# EAGLE design main (EAGLE 6.1)
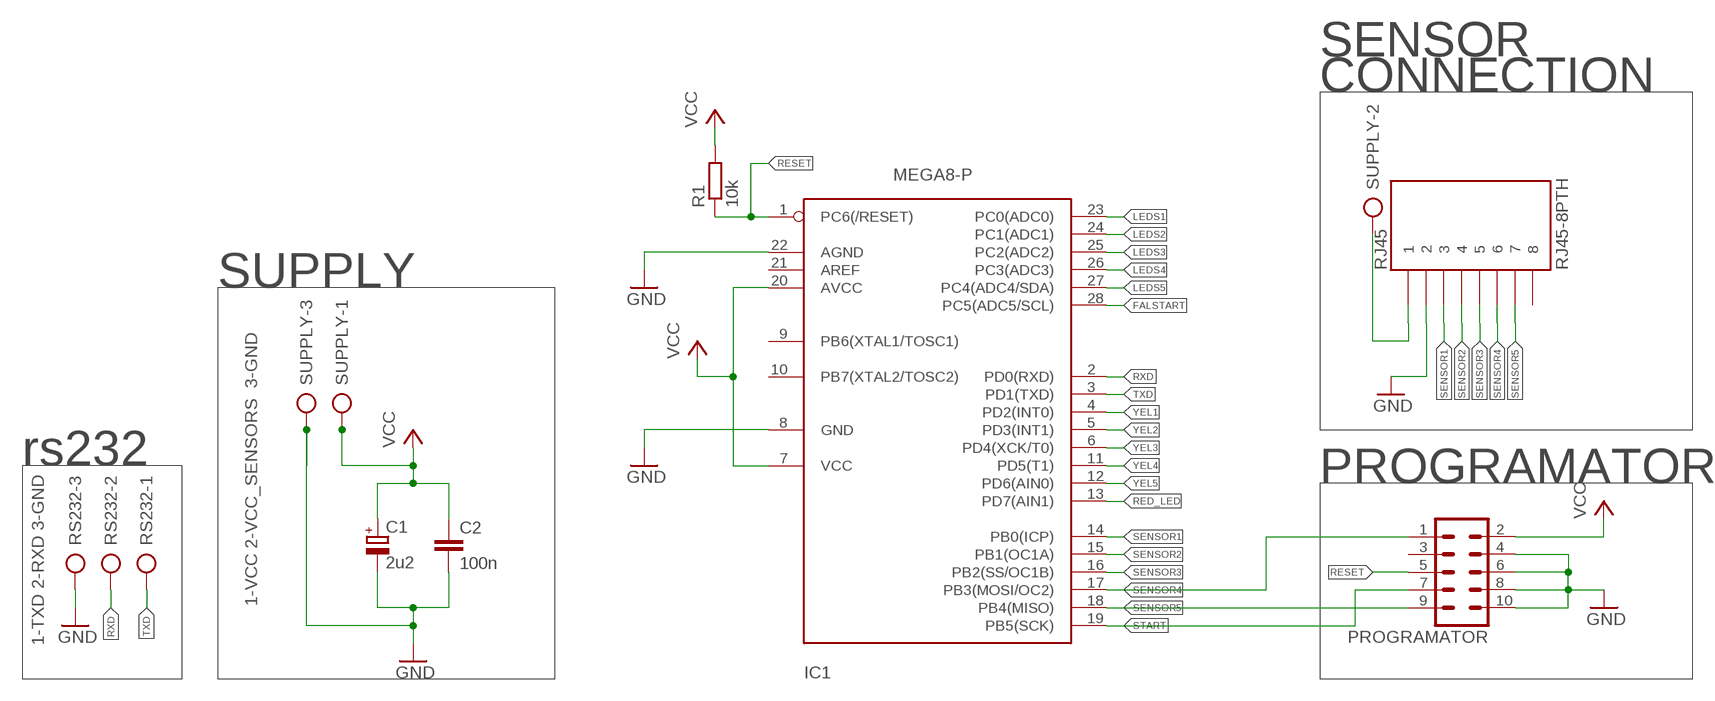
[diagram p0: schematic, sheet 1, part 1 of 2]
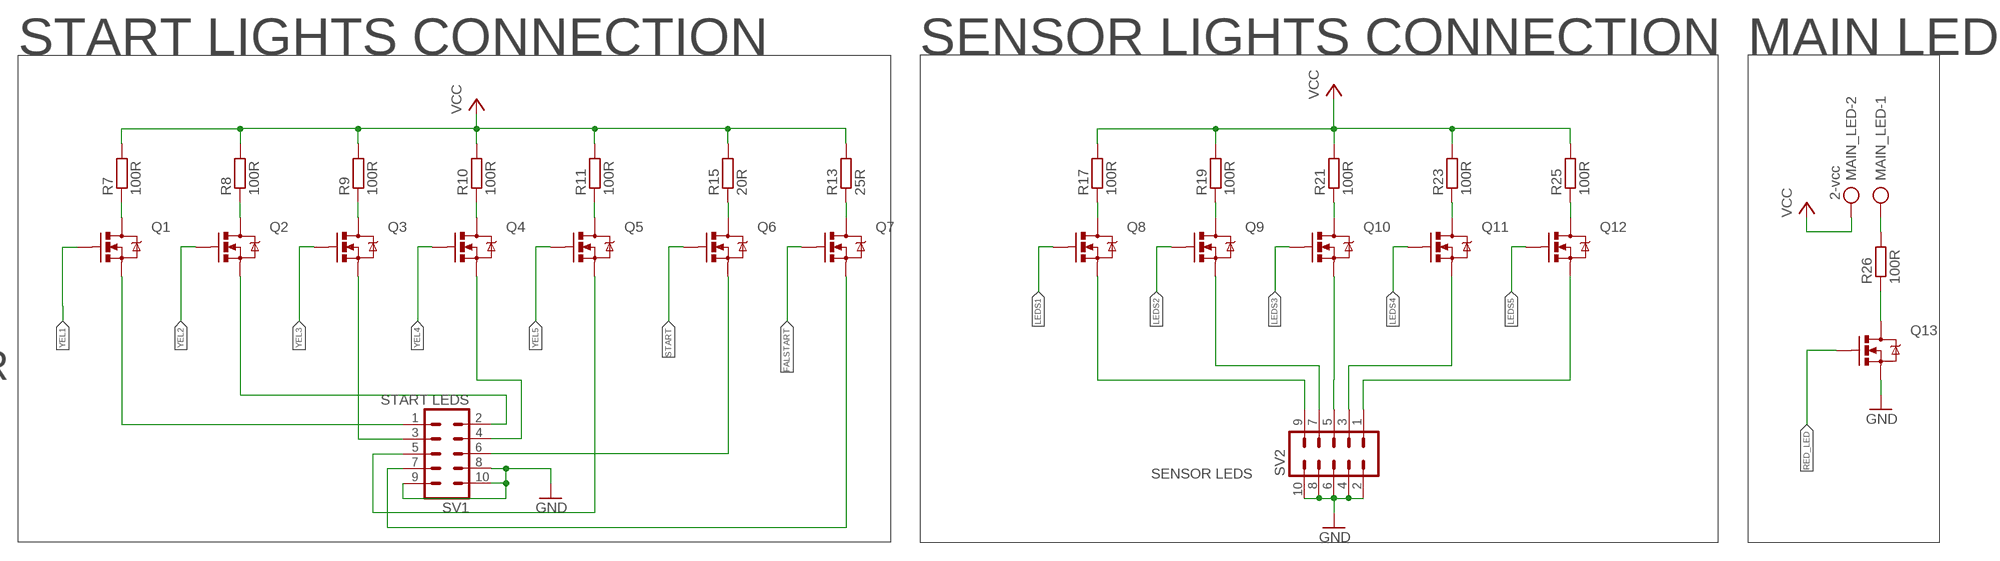
[diagram p1: schematic, sheet 1, part 2 of 2]

## Parts
C1  2u2  CPOL-EUE2-5  [E2-5]
C2  100n  C-EUC0805  [C0805]
IC1  MEGA8-P  [DIL28-3]
MAIN_LED  2-vcc  AK300/2  [AK300/2]
PROGRAMATOR  ML10L  [ML10L]
Q1  MOSFET-NCHANNEL2N7002PW  [SOT323]
Q2  MOSFET-NCHANNEL2N7002PW  [SOT323]
Q3  MOSFET-NCHANNEL2N7002PW  [SOT323]
Q4  MOSFET-NCHANNEL2N7002PW  [SOT323]
Q5  MOSFET-NCHANNEL2N7002PW  [SOT323]
Q6  MOSFET-NCHANNEL2N7002PW  [SOT323]
Q7  MOSFET-NCHANNEL2N7002PW  [SOT323]
Q8  MOSFET-NCHANNEL2N7002PW  [SOT323]
Q9  MOSFET-NCHANNEL2N7002PW  [SOT323]
Q10  MOSFET-NCHANNEL2N7002PW  [SOT323]
Q11  MOSFET-NCHANNEL2N7002PW  [SOT323]
Q12  MOSFET-NCHANNEL2N7002PW  [SOT323]
Q13  MOSFET-NCHANNEL2N7002PW  [SOT323]
R1  10k  R-EU_R0805  [R0805]
R7  100R  R-EU_R0805  [R0805]
R8  100R  R-EU_R0805  [R0805]
R9  100R  R-EU_R0805  [R0805]
R10  100R  R-EU_R0805  [R0805]
R11  100R  R-EU_R0805  [R0805]
R13  25R  R-EU_R0805  [R0805]
R15  20R  R-EU_R0805  [R0805]
R17  100R  R-EU_R0805  [R0805]
R19  100R  R-EU_R0805  [R0805]
R21  100R  R-EU_R0805  [R0805]
R23  100R  R-EU_R0805  [R0805]
R25  100R  R-EU_R0805  [R0805]
R26  100R  R-EU_R0805  [R0805]
RJ45  RJ45-8PTH  [RJ45-8]
RS232  1-TXD 2-RXD 3-GND  AK300/3  [AK300/3]
SUPPLY  1-VCC 2-VCC_SENSORS 3-GND  AK300/3  [AK300/3]
SV1  START LEDS  ML10  [ML10]
SV2  SENSOR LEDS  ML10  [ML10]

## Nets
FALSTART: IC1.28(PC5(ADC5/SCL)) Q7.1(G)
GND: C1.- C2.2 IC1.8(GND) IC1.22(AGND) PROGRAMATOR.4 PROGRAMATOR.6 PROGRAMATOR.8 PROGRAMATOR.10 Q13.2(S) RJ45.2 RS232.3 SUPPLY.3 SV1.8 SV1.9 SV1.10 SV2.2 SV2.4 SV2.6 SV2.8 SV2.10
LEDS1: IC1.23(PC0(ADC0)) Q8.1(G)
LEDS2: IC1.24(PC1(ADC1)) Q9.1(G)
LEDS3: IC1.25(PC2(ADC2)) Q10.1(G)
LEDS4: IC1.26(PC3(ADC3)) Q11.1(G)
LEDS5: IC1.27(PC4(ADC4/SDA)) Q12.1(G)
N$1: Q1.3(D) R7.1
N$2: Q8.2(S) SV2.9
N$3: Q2.3(D) R8.1
N$4: Q3.3(D) R9.1
N$5: Q4.3(D) R10.1
N$6: Q5.3(D) R11.1
N$7: Q9.2(S) SV2.7
N$8: Q11.2(S) SV2.3
N$9: Q12.2(S) SV2.1
N$10: Q7.3(D) R13.1
N$12: Q6.3(D) R15.1
N$14: Q8.3(D) R17.1
N$16: Q9.3(D) R19.1
N$18: Q10.3(D) R21.1
N$20: Q11.3(D) R23.1
N$22: Q12.3(D) R25.1
N$23: Q10.2(S) SV2.5
N$26: Q1.2(S) SV1.1
N$27: Q2.2(S) SV1.2
N$28: Q3.2(S) SV1.3
N$29: Q4.2(S) SV1.4
N$30: Q5.2(S) SV1.5
N$31: Q6.2(S) SV1.6
N$32: Q7.2(S) SV1.7
N$33: RJ45.1 SUPPLY.2
N$34: Q13.3(D) R26.1
N$35: MAIN_LED.1 R26.2
RED_LED: IC1.13(PD7(AIN1)) Q13.1(G)
RESET: IC1.1(PC6(/RESET)) PROGRAMATOR.5 R1.1
RXD: IC1.2(PD0(RXD)) RS232.2
SENSOR1: IC1.14(PB0(ICP)) RJ45.3
SENSOR2: IC1.15(PB1(OC1A)) RJ45.4
SENSOR3: IC1.16(PB2(SS/OC1B)) RJ45.5
SENSOR4: IC1.17(PB3(MOSI/OC2)) PROGRAMATOR.1 RJ45.6
SENSOR5: IC1.18(PB4(MISO)) PROGRAMATOR.9 RJ45.7
START: IC1.19(PB5(SCK)) PROGRAMATOR.7 Q6.1(G)
TXD: IC1.3(PD1(TXD)) RS232.1
VCC: C1.+ C2.1 IC1.7(VCC) IC1.20(AVCC) MAIN_LED.2 PROGRAMATOR.2 R1.2 R7.2 R8.2 R9.2 R10.2 R11.2 R13.2 R15.2 R17.2 R19.2 R21.2 R23.2 R25.2 SUPPLY.1
YEL1: IC1.4(PD2(INT0)) Q1.1(G)
YEL2: IC1.5(PD3(INT1)) Q2.1(G)
YEL3: IC1.6(PD4(XCK/T0)) Q3.1(G)
YEL4: IC1.11(PD5(T1)) Q4.1(G)
YEL5: IC1.12(PD6(AIN0)) Q5.1(G)
Unconnected: IC1.9(PB6(XTAL1/TOSC1)) IC1.10(PB7(XTAL2/TOSC2)) IC1.21(AREF) PROGRAMATOR.3 RJ45.8

## Notes on the sheet
- SENSOR
- CONNECTION | START LIGHTS CONNECTION | SENSOR LIGHTS CONNECTION | MAIN LED
- SUPPLY
- rs232
- PROGRAMATOR

## Library data of the parts
C1 = rcl:CPOL-EU: POLARIZED CAPACITOR, European symbol
C2 = rcl:C-EU: CAPACITOR, European symbol
IC1 = avr-4:MEGA8-P: MICROCONTROLLER 8 Kbytes FLASH 1 kbytes SRAM 512 bytes EEPROM USART 4-channel 10 bit ADC 2-channel 8 bit ADC
MAIN_LED = con-ptr500:AK300/2: CONNECTOR; OC_FARNELL: unknown; OC_NEWARK: unknown
PROGRAMATOR SV1 SV2 = con-harting-ml:ML10: HARTING; OC_FARNELL: unknown; OC_NEWARK: unknown
Q1-Q13 = SparkFun-DiscreteSemi:MOSFET-NCHANNEL: Common NMOSFET Parts MFG P/N Store ID Prod ID FDD8780 TRANS-09984 SI7820DN TRANS-11055 FDS6630A IC-08089 2N7002PW TRANS-11151 FQP30N06L COM-10213 TRANS-10060 BSS123LT1G TRANS-08345 BSS138 TRANS-00830 BS170 2N7000; PROD_ID: TRANS-11151
R1 R7-R11 R13 R15 R17 R19 R21 R23 R25 R26 = rcl:R-EU_: RESISTOR, European symbol
RJ45 = SparkFun:RJ45-8: RJ45 Jack Simple RJ45, 8-pin connection - connector for common Cat5, Cat5e, and Cat6 Ethernet cables. Footprint not yet proven in production. Connector sku is PRT-00643; Breakout PCB sku is BOB-00716.
RS232 SUPPLY = con-ptr500:AK300/3: CONNECTOR; OC_FARNELL: unknown; OC_NEWARK: unknown

## Board
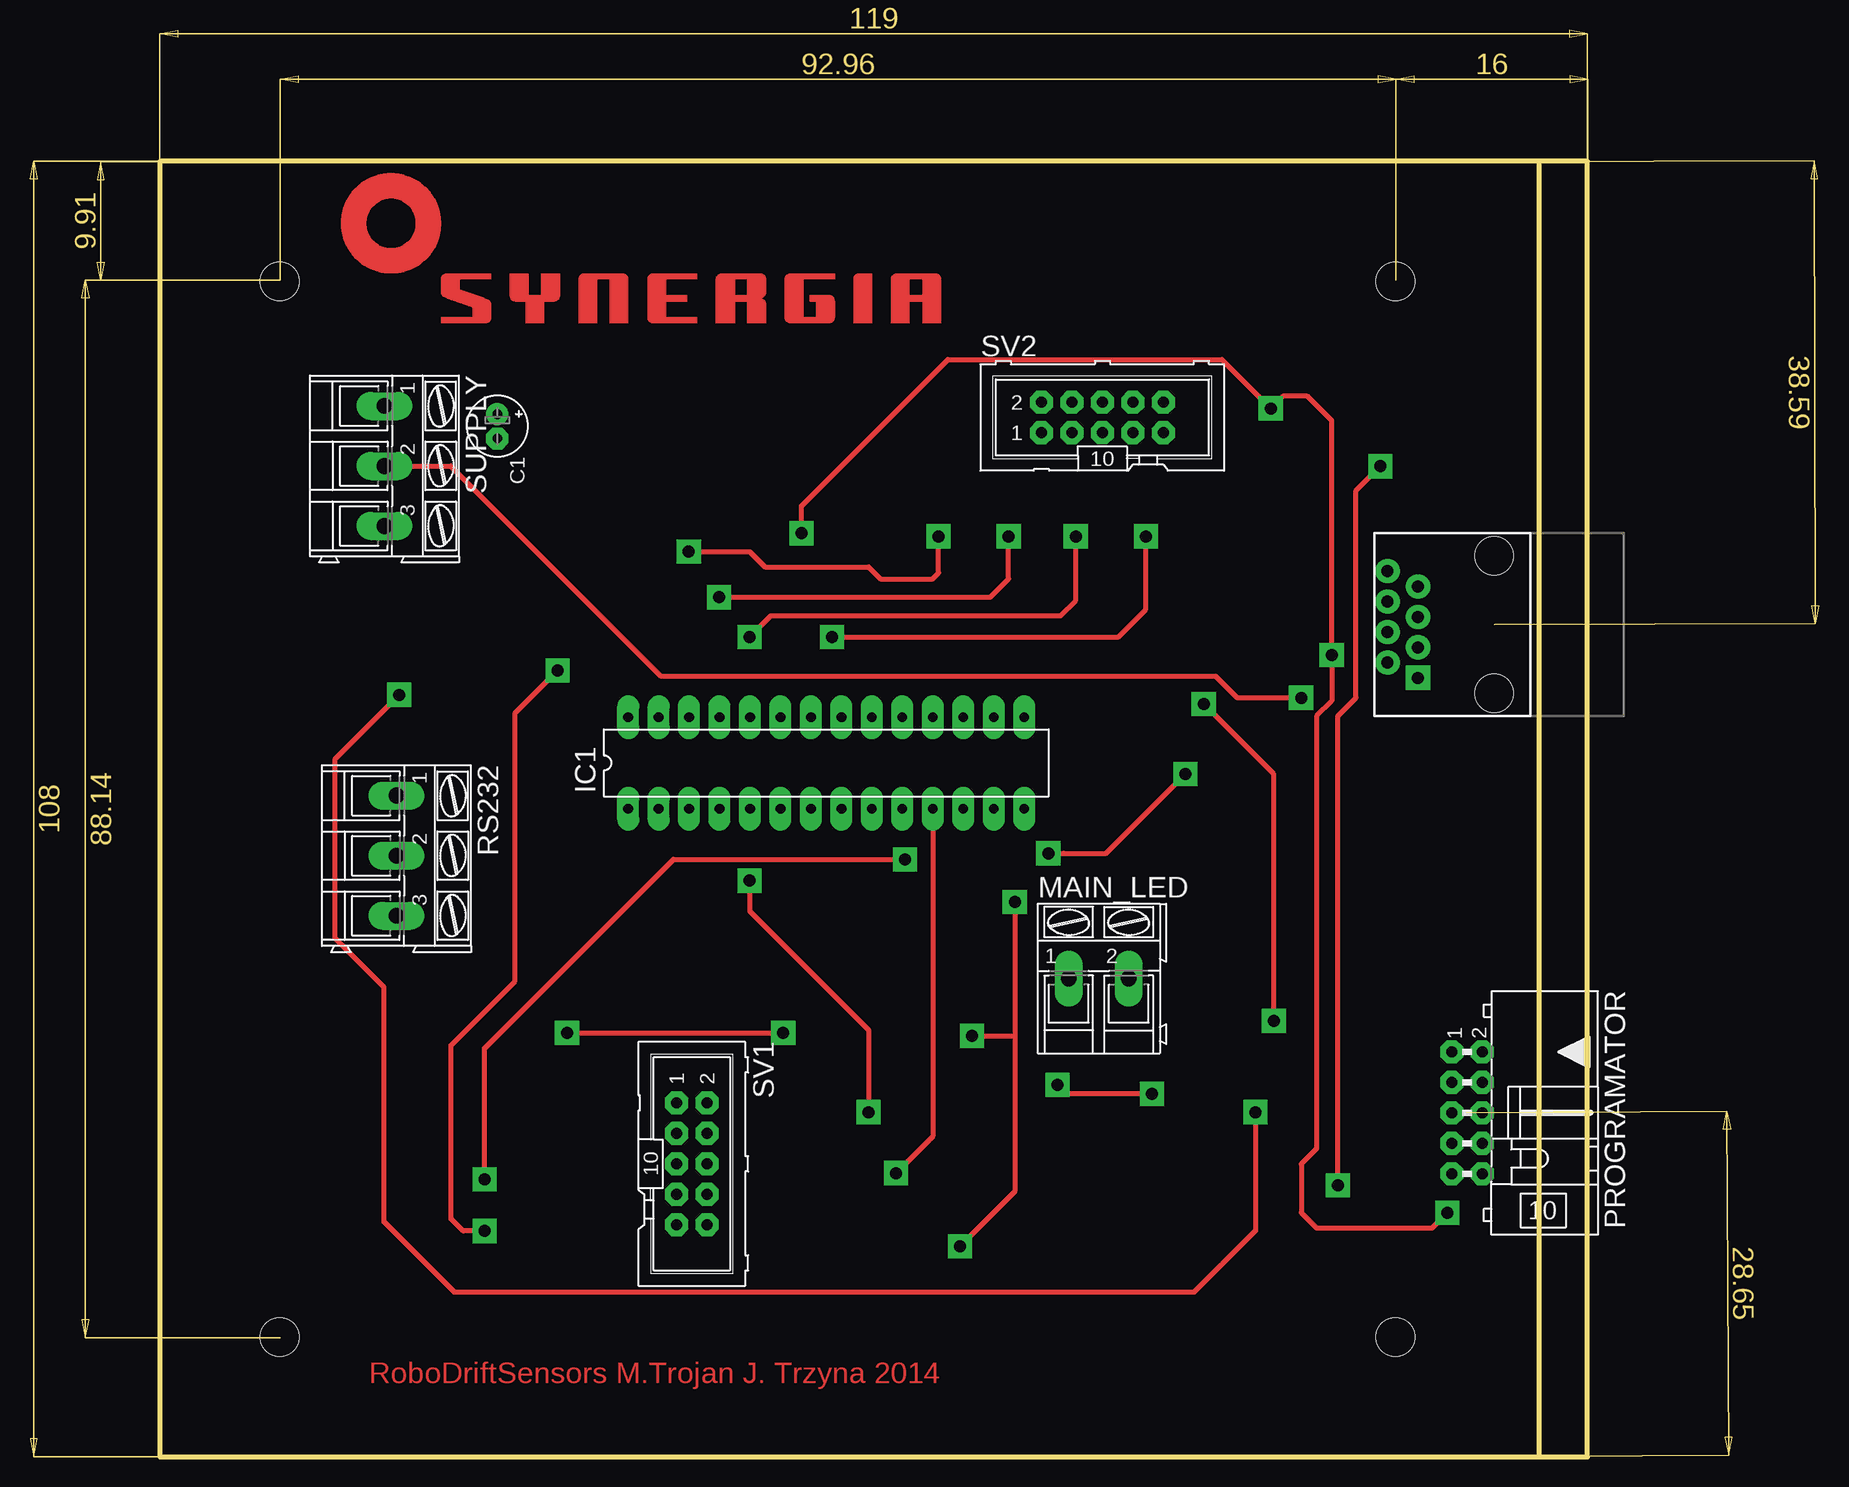
[diagram p2: board, top side]
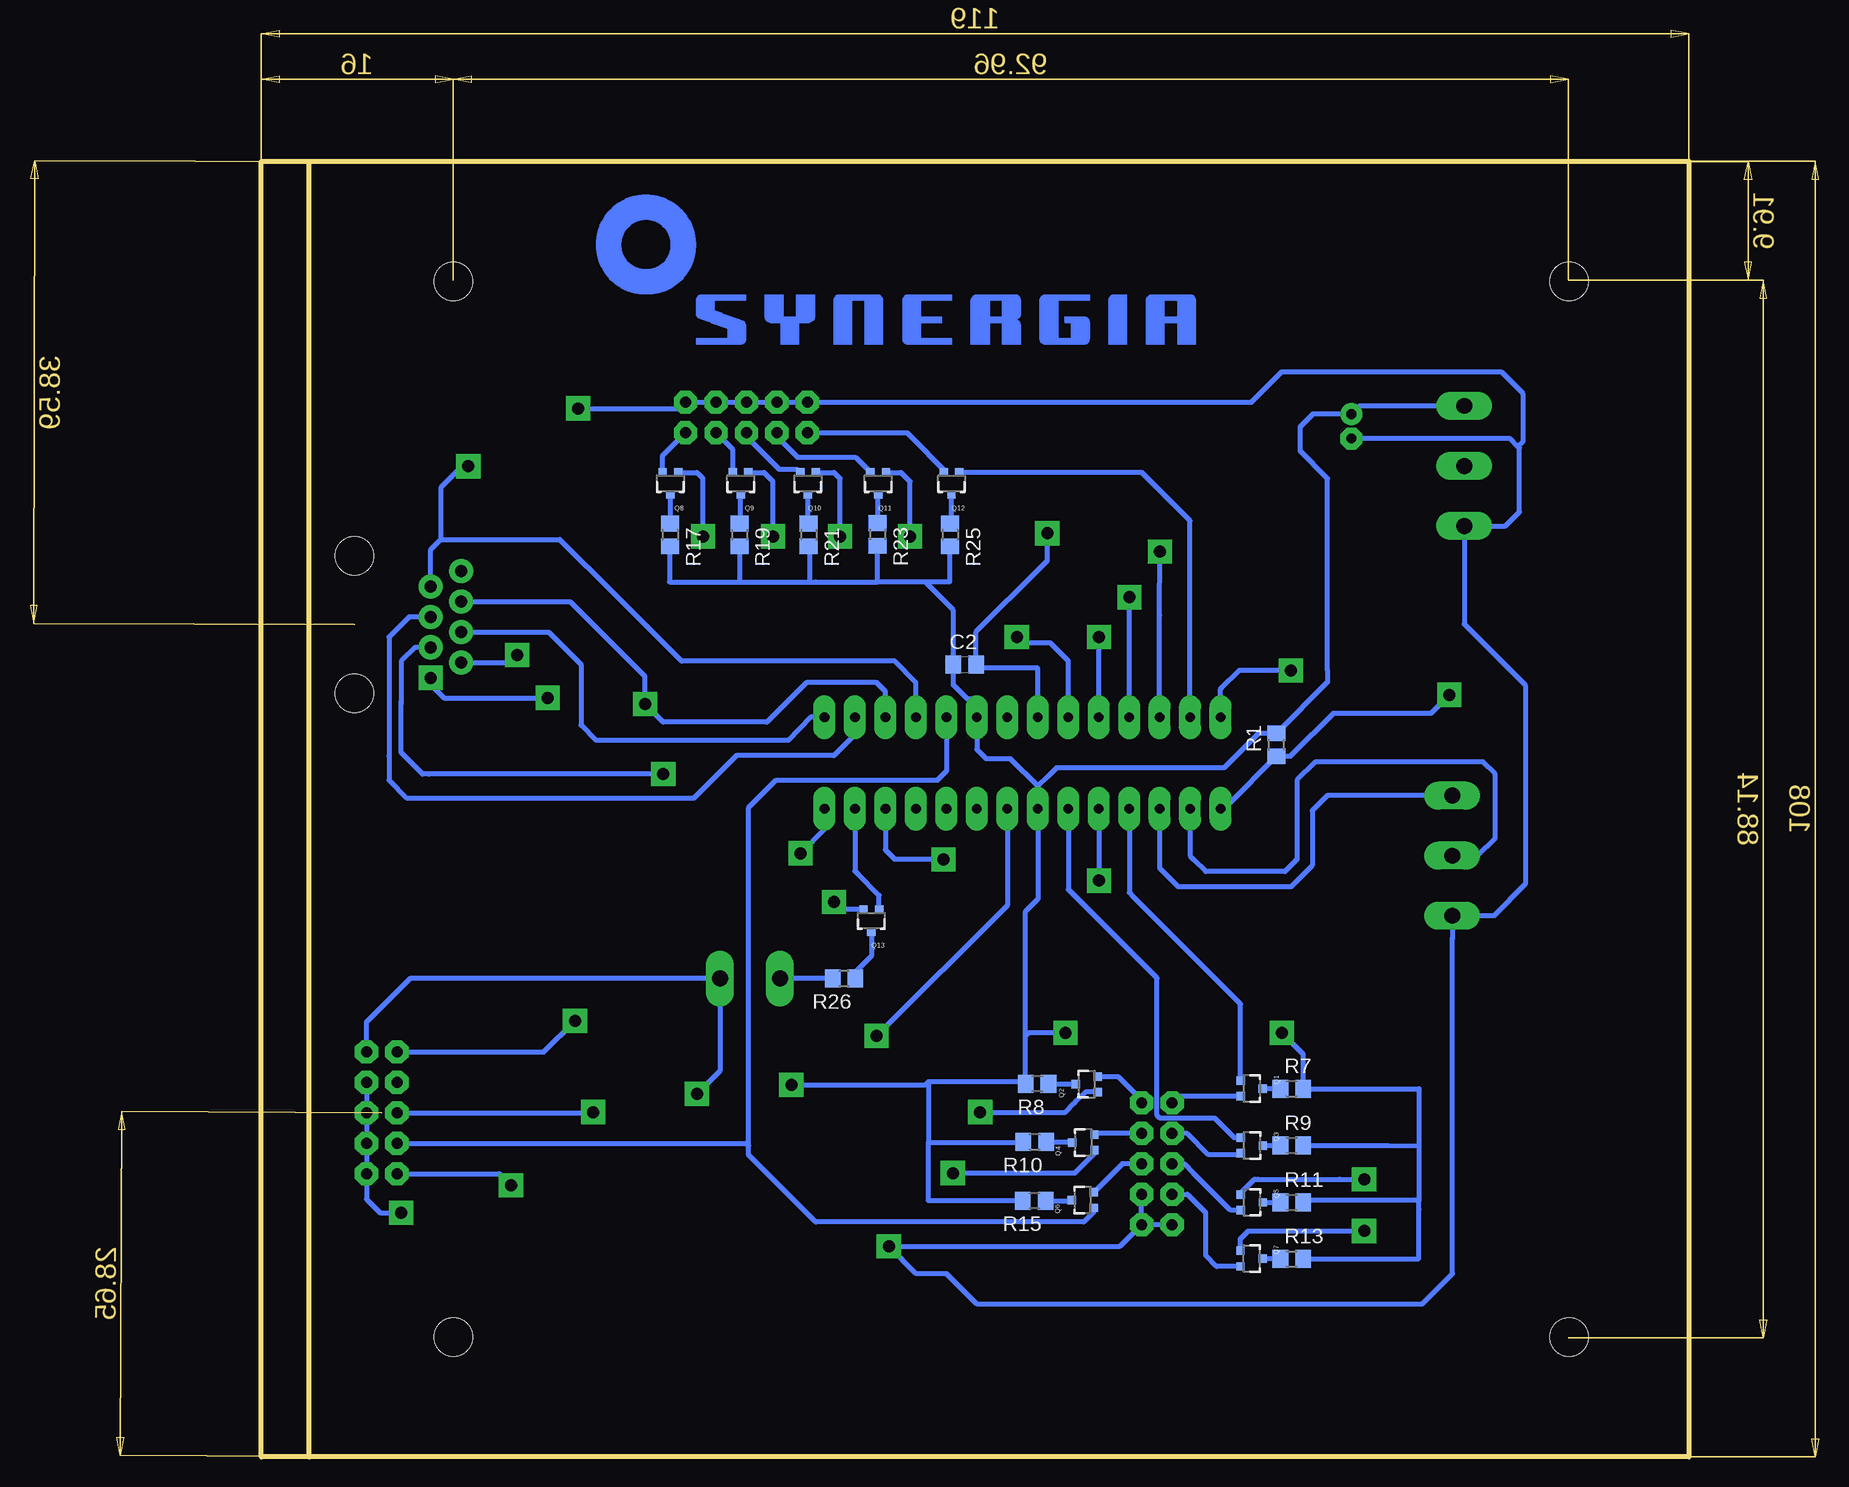
[diagram p3: board, bottom side, seen from below]

Size 119 x 108 mm. Coordinates in mm from the lower left corner, seen from the top.
Outline: 115,0 115,108
Outline: 115,108 0,108 0,0 115,0
Outline: 115,0 119,0 119,108 115,108
Copper layers (1*16): Top 0.035mm / dielectric 1.5mm / Bottom 0.035mm
Design rules "default": minimum track width 10mil, minimum drill 24mil, track to track 8mil, track to pad 8mil, pad to pad 8mil, via to via 8mil, smd to smd 8mil, copper to edge 40mil, drill to drill 8mil, minimum pad ring 20mil, minimum via ring 20mil, stop-mask expansion 4mil, vias tented up to drill 0mil, thermal gap 10mil
Holes 3.2 mm at 103,10 103,98 10,98 10,10

### Footprints (pad centres in the part's own frame; a part is rotated, then mirrored left to right if it is on the bottom)
E2-5 = drill 0.813 pad 1.27: + -1.016,0 | drill 0.813 pad 1.27 octagon: - 1.016,0
C0805 = smd 1.3 x 1.5: 1 -0.95,0; 2 0.95,0
DIL28-3 = drill 0.813 long: 1 -16.51,-3.81; 2 -13.97,-3.81; 3 -11.43,-3.81; 4 -8.89,-3.81; 5 -6.35,-3.81; 6 -3.81,-3.81; 7 -1.27,-3.81; 8 1.27,-3.81; 9 3.81,-3.81; 10 6.35,-3.81; 11 8.89,-3.81; 12 11.43,-3.81; 13 13.97,-3.81; 14 16.51,-3.81; 15 16.51,3.81; 16 13.97,3.81; 17 11.43,3.81; 18 8.89,3.81; 19 6.35,3.81; 20 3.81,3.81; 21 1.27,3.81; 22 -1.27,3.81; 23 -3.81,3.81; 24 -6.35,3.81; 25 -8.89,3.81; 26 -11.43,3.81; 27 -13.97,3.81; 28 -16.51,3.81
AK300/2 = drill 1.321 long: 1 -2.515,0; 2 2.489,0
ML10L = drill 0.914 octagon: 1 -5.08,-1.27; 2 -5.08,1.27; 3 -2.54,-1.27; 4 -2.54,1.27; 5 0,-1.27; 6 0,1.27; 7 2.54,-1.27; 8 2.54,1.27; 9 5.08,-1.27; 10 5.08,1.27
SOT323 = smd 0.7 x 0.7: 1 -0.65,-0.925; 2 0.65,-0.925; 3 0,0.925
R0805 = smd 1.3 x 1.5: 1 -0.95,0; 2 0.95,0
RJ45-8 = drill 1 pad 1.88 square: 1 -4.445,6.35 | drill 1 pad 1.88: 2 -3.175,8.89; 3 -1.905,6.35; 4 -0.635,8.89; 5 0.635,6.35; 6 1.905,8.89; 7 3.175,6.35; 8 4.445,8.89 | hole 3.2: -5.715,0; 5.715,0
AK300/3 = drill 1.321 long: 1 -5.004,0; 2 0,0; 3 5.004,0
ML10 = drill 0.914 octagon: 1 -5.08,-1.27; 2 -5.08,1.27; 3 -2.54,-1.27; 4 -2.54,1.27; 5 0,-1.27; 6 0,1.27; 7 2.54,-1.27; 8 2.54,1.27; 9 5.08,-1.27; 10 5.08,1.27

### Placement (x,y rotation side)
C1  28.14,85.92 270 top
C2  60.37,66.06 0 bottom
IC1  55.55,57.85 0 top
MAIN_LED  78.28,39.88 0 top
PROGRAMATOR  108.97,28.68 270 top
Q1  36.45,30.71 270 bottom
Q2  50.2,31.07 90 bottom
Q3  36.44,25.96 270 bottom
Q4  50.48,26.21 90 bottom
Q5  36.44,21.22 270 bottom
Q6  50.53,21.41 90 bottom
Q7  36.47,16.53 270 bottom
Q8  84.91,81.15 180 bottom
Q9  79.05,81.15 180 bottom
Q10  73.44,81.15 180 bottom
Q11  67.59,81.15 180 bottom
Q12  61.47,81.15 180 bottom
Q13  68.16,44.7 180 bottom
R1  34.39,59.37 90 bottom
R7  33.11,30.7 0 bottom
R8  54.34,31.09 180 bottom
R9  33.11,25.96 0 bottom
R10  54.54,26.24 180 bottom
R11  33.11,21.22 0 bottom
R13  33.11,16.52 0 bottom
R15  54.58,21.35 180 bottom
R17  84.92,76.86 270 bottom
R19  79.15,76.86 270 bottom
R21  73.37,76.86 270 bottom
R23  67.63,76.9 270 bottom
R25  61.58,76.86 270 bottom
R26  70.44,39.88 180 bottom
RJ45  111.24,69.39 90 top
RS232  19.73,50.12 270 top
SUPPLY  18.73,82.61 270 top
SV1  44.35,24.43 270 top
SV2  78.57,86.65 0 top
U$1  [SYNERGIA_50MM]  15.14,94.52 0 top
U$2  [SYNERGIA_50MM]  91.08,92.74 0 bottom

### Tracks (layer width: path | path; a pad name or v marks a point on that pad's centre or on a via)
FALSTART  (via drill 1)
  Top 0.406: v27.08,18.83 25.3,18.83 24.28,19.84 24.28,34.32 29.62,39.66 29.62,62.01 v33.17,65.56
  Bottom 0.406: Q7.1 37.4,18.16 36.73,18.83 36.22,18.83 v27.08,18.83 | v33.17,65.56 37.49,65.56 39.01,64.04 39.04,64.01 IC1.28
GND  (via drill 1)
  Top 0.406: v107.34,20.35 106.07,19.08 96.42,19.08 95.15,20.35 95.15,24.42 96.42,25.69 96.42,61.75 97.69,63.02 v97.69,66.83 97.69,86.39 95.66,88.42 93.62,88.42 v92.61,87.41 88.54,91.47 65.68,91.47 53.49,79.28 v53.49,76.99 | v71.27,46.26 71.27,35.08 | 71.27,35.08 71.27,22.13 v66.7,17.56 | v67.72,35.08 71.27,35.08
  Bottom 0.406: PROGRAMATOR.4 PROGRAMATOR.6 PROGRAMATOR.8 PROGRAMATOR.10 110.24,21.47 109.12,20.35 v107.34,20.35 | SV1.9 SV1.10 | SV1.10 SV1.8 | 14.25,84.23 14.12,84.11 14.12,78.77 15.29,77.61 SUPPLY.3 18.73,69.41 18.69,69.37 13.61,64.29 13.61,47.78 16.28,45.12 RS232.3 19.73,43.23 19.71,43.21 19.71,15.27 22.25,12.73 59.33,12.73 61.87,15.27 64.41,15.27 v66.7,17.56 47.41,17.56 SV1.10 | 14.25,84.23 14.88,84.87 28.1,84.87 C1.- | RJ45.2 98.31,66.22 v97.69,66.83 | v92.61,87.41 84.16,87.41 SV2.10 SV2.8 SV2.6 SV2.4 SV2.2 36.47,87.92 33.93,90.46 15.65,90.46 13.87,88.68 13.87,84.61 14.25,84.23 | IC1.22 54.28,65.75 59.27,65.75 59.33,65.82 C2.2 59.42,68.78 54,74.2 53.49,74.71 v53.49,76.99 | Q13.2 70.64,45.63 v71.27,46.26 | IC1.8 56.82,45.98 v67.72,35.08
LEDS1  (via drill 1)
  Top 0.406: v56.03,68.36 79.91,68.36 82.19,70.64 v82.19,76.74
  Bottom 0.406: IC1.23 51.74,66.35 53.24,67.85 55.52,67.85 v56.03,68.36 | v82.19,76.74 82.19,77.76 82.19,81.57 82.45,81.82 82.7,82.07 Q8.1
LEDS2  (via drill 1)
  Top 0.406: v49.17,68.36 50.95,70.14 52.98,70.14 75.08,70.14 76.35,71.41 76.35,76.49 v76.35,76.74
  Bottom 0.406: IC1.24 49.2,66.35 v49.17,68.36 | v76.35,76.74 76.35,81.31 77.11,82.07 77.12,82.07 Q9.1
LEDS3  (via drill 1)
  Top 0.406: v46.63,71.66 69.24,71.66 70.76,73.18 v70.76,76.74
  Bottom 0.406: IC1.25 46.66,68.13 v46.63,71.66 | v70.76,76.74 70.76,81.57 71.27,82.07 Q10.1
LEDS4  (via drill 1)
  Top 0.406: v44.09,75.47 49.17,75.47 50.44,74.2 59.08,74.2 60.1,73.18 64.41,73.18 64.92,73.69 v64.92,76.74
  Bottom 0.406: IC1.26 44.12,70.16 v44.09,75.47 | v64.92,76.74 64.92,81.31 65.68,82.07 65.69,82.07 Q11.1
LEDS5
  Bottom 0.406: IC1.27 41.58,78.04 45.62,82.07 52.47,82.07 Q12.1
N$1
  Bottom 0.406: R7.1 35.51,30.7 Q1.3
N$2
  Bottom 0.406: Q8.2 85.56,83.47 SV2.9
N$3
  Bottom 0.406: Q2.3 53.37,31.07 R8.1
N$4
  Bottom 0.406: Q3.3 R9.1
N$5
  Bottom 0.406: Q4.3 53.56,26.21 R10.1
N$6
  Bottom 0.406: Q5.3 R11.1
N$7
  Bottom 0.406: Q9.2 79.7,83.97 SV2.7
N$8
  Bottom 0.406: Q11.2 68.24,82.09 69.24,83.09 69.49,83.34 74.32,83.34 76.03,85.05 SV2.3
N$9
  Bottom 0.406: Q12.2 62.12,82.32 64.67,84.87 65.18,85.38 SV2.1
N$10
  Bottom 0.406: Q7.3 34.06,16.53 R13.1
N$11
  cutout Top (isolate 0.508): -2.13,-2 121.31,-2 121.31,109.25 -2.13,109.25
N$12
  Bottom 0.406: R15.1 51.51,21.35 Q6.3
N$13
  cutout Bottom (isolate 0.508): -2.13,-1.75 121.06,-1.75 121.06,109 -2.13,109
N$14
  Bottom 0.406: R17.1 84.91,77.81 Q8.3
N$16
  Bottom 0.406: R19.1 79.05,77.81 Q9.3
N$18
  Bottom 0.406: R21.1 73.44,77.81 Q10.3
N$20
  Bottom 0.406: R23.1 67.59,77.85 Q11.3
N$22
  Bottom 0.406: R25.1 61.47,77.81 Q12.3
N$23
  Bottom 0.406: SV2.5 78.57,85.05 75.84,82.33 74.35,82.33 Q10.2
N$26
  Bottom 0.406: Q1.2 42.53,30.06 SV1.1
N$27
  Bottom 0.406: SV1.2 45.62,29.75 47.4,31.53 47.58,31.72 Q2.2
N$28
  Bottom 0.406: Q3.2 37.49,25.19 40.04,25.19 41.81,26.96 43.07,26.96 SV1.3
N$29
  Bottom 0.406: SV1.4 49.45,26.97 Q4.2
N$30
  Bottom 0.406: Q5.2 38.22,20.57 41.3,23.65 42.08,24.43 SV1.5
N$31
  Bottom 0.406: SV1.6 47.24,24.43 Q6.2
N$32
  Bottom 0.406: Q7.2 39.37,15.88 40.28,16.8 40.28,20.35 41.3,21.37 41.82,21.89 SV1.7
N$33  (via drill 1)
  Top 0.406: v95.15,63.28 89.81,63.28 88.04,65.06 41.81,65.06 24.92,81.95 | 24.92,81.95 24.79,82.07 | SUPPLY.2 24.25,82.61 24.92,81.95
  Bottom 0.406: RJ45.1 104.89,64.38 103.78,63.28 v95.15,63.28
N$34
  Bottom 0.406: R26.1 69.49,40.43 68.22,41.69 68.16,41.75 Q13.3
N$35
  Bottom 0.406: R26.2 MAIN_LED.1
RED_LED
  Bottom 0.406: Q13.1 67.51,46.82 69.24,48.55 69.52,48.83 IC1.13
RESET  (via drill 1)
  Top 0.406: v91.34,28.73 91.34,18.83 88.54,16.03 86.26,13.75 24.54,13.75 22.25,16.03 18.69,19.59 18.69,34.83 18.69,39.15 14.63,43.21 14.63,58.2 v19.96,63.53
  Bottom 0.406: PROGRAMATOR.5 91.39,28.68 v91.34,28.73 | IC1.1 38.72,54.36 38.45,54.36 R1.1 33.2,58.42 33.17,58.45 29.62,62.01 21.49,62.01 v19.96,63.53
RXD
  Bottom 0.406: RS232.2 17.63,50.12 16.15,51.59 16.15,56.93 17.17,57.94 31.14,57.94 32.66,56.42 32.66,49.82 33.68,48.8 40.28,48.8 41.3,49.82 41.58,50.1 IC1.2
SENSOR1  (via drill 1)
  Top 0.406: v74.07,50.32 75.34,50.32 78.89,50.32 v85.5,56.93
  Bottom 0.406: RJ45.3 106.18,67.48 107.34,66.33 107.34,63.02 | IC1.14 72.06,52.33 v74.07,50.32 | v85.5,56.93 105.05,56.93 105.56,56.93 107.34,58.71 107.34,63.02 | 107.34,63.02 107.34,62.77
SENSOR2
  Bottom 0.406: IC1.15 73.21,61.66 75.08,59.72 91.08,59.72 92.35,60.99 92.35,66.07 95.04,68.75 RJ45.4
SENSOR3
  Bottom 0.406: RJ45.5 106.69,70.03 108.36,68.36 108.36,58.45 108.36,56.42 106.83,54.9 82.96,54.9 79.4,58.45 71.27,58.45 69.52,60.2 IC1.16
SENSOR4  (via drill 1)
  Top 0.406: v92.86,36.35 92.86,56.93 v87.02,62.77
  Bottom 0.406: IC1.17 66.98,63.81 67.72,64.55 73.56,64.55 76.86,61.25 85.5,61.25 v87.02,62.77 87.02,65.06 92.74,70.77 | RJ45.6 93.26,71.3 92.74,70.77 | 92.74,70.77 92.61,70.64 | PROGRAMATOR.1 95.46,33.76 v92.86,36.35
SENSOR5  (via drill 1)
  Top 0.406: v98.2,22.64 98.2,61.75 99.72,63.28 99.72,80.55 v101.75,82.58
  Bottom 0.406: RJ45.7 104.89,75.63 104.04,76.49 | 104.04,76.49 94.13,76.49 89.56,71.91 83.97,66.33 66.19,66.33 64.44,64.57 IC1.18 | PROGRAMATOR.9 99.16,23.6 v98.2,22.64 | v101.75,82.58 102.26,82.58 104.04,80.8 104.04,76.49
START
  Bottom 0.406: 78.38,25.94 78.38,25.18 73.81,20.61 72.8,19.59 50.44,19.59 49.61,20.43 Q6.1 | 78.38,25.94 78.38,54.13 76.1,56.42 62.64,56.42 61.87,57.18 61.9,57.21 IC1.19 | PROGRAMATOR.7 78.58,26.14 78.38,25.94
TXD
  Bottom 0.406: RS232.1 30.15,55.12 31.39,53.88 31.39,49.31 33.17,47.53 42.57,47.53 43.84,48.8 44.12,49.08 IC1.3
VCC  (via drill 1)
  Top 0.406: v82.7,30.26 75.59,30.26 v74.83,31.02 | v33.93,35.34 v51.97,35.34
  Bottom 0.406: R13.2 22.53,16.52 22.5,20.61 22.5,21.37 | 22.5,21.37 32.02,21.37 R11.2 | R9.2 25.07,25.96 22.5,25.94 | 22.5,25.94 22.5,21.37 | 22.5,25.94 22.5,30.7 R7.2 32.16,33.56 v33.93,35.34 | 54.28,55.89 IC1.7 54.28,46.54 54.25,46.51 55.29,45.48 55.29,35.08 | 54.28,55.89 54.25,55.91 53.49,56.67 52.73,57.44 50.95,57.44 38.76,57.44 35.88,60.32 R1.2 30.12,64.58 30.12,65.56 30.12,81.57 32.41,83.85 32.41,85.88 31.39,86.9 31.36,86.94 C1.+ 27.46,87.61 SUPPLY.1 | 54.28,55.89 54.28,55.94 56.54,58.2 58.57,58.2 59.08,58.71 59.36,58.99 IC1.20 59.36,63.19 60.16,63.19 61.31,64.34 C2.1 61.32,70.59 63.65,72.93 | R10.2 55.49,26.19 63.4,26.19 | R8.2 55.29,31.27 | 55.29,31.27 63.4,31.27 | 63.4,31.27 63.4,26.19 | R25.2 61.62,75.91 61.62,72.93 63.65,72.93 | 63.65,72.93 67.63,72.93 | 67.63,72.93 R23.2 | R21.2 73.3,75.91 73.3,72.93 72.8,72.93 | 72.8,72.93 67.63,72.93 | R19.2 79.15,72.93 | 79.15,72.93 72.8,72.93 | R17.2 84.99,75.91 84.99,72.93 79.15,72.93 | 55.29,31.27 55.29,35.08 | PROGRAMATOR.2 110.24,36.25 110.13,36.35 106.61,39.88 MAIN_LED.2 80.77,32.19 v82.7,30.26 | R15.2 63.4,21.35 63.4,26.19 | v74.83,31.02 63.65,31.02 63.4,31.27 | v51.97,35.34 55.04,35.34 55.29,35.08
YEL1
  Bottom 0.406: Q1.1 37.37,37.76 46.38,46.77 46.66,47.05 IC1.4
YEL2  (via drill 1)
  Top 0.406: v49.17,48.04 49.17,45.5 59.08,35.59 v59.08,28.73
  Bottom 0.406: Q2.1 50.29,30.42 51.21,29.5 51.97,28.73 v59.08,28.73 | IC1.5 49.2,48.06 v49.17,48.04
YEL3
  Bottom 0.406: IC1.6 51.74,47.3 50.19,45.75 44.35,39.91 44.35,28.48 44.09,28.23 41.81,28.23 39.52,28.23 37.91,26.61 Q3.1
YEL4  (via drill 1)
  Top 0.406: v61.37,23.65 63.4,25.69 64.16,26.45 64.44,26.73 IC1.11
  Bottom 0.406: Q4.1 49.56,25.3 51.21,23.65 v61.37,23.65
YEL5  (via drill 1)
  Top 0.406: v27.08,23.15 27.08,34.07 42.82,49.82 v62.13,49.82
  Bottom 0.406: v27.08,23.15 29.11,23.15 35.97,23.15 36.22,23.15 37.37,22 Q5.1 | v62.13,49.82 66.19,49.82 66.98,50.6 IC1.12

### Text on the board
Top: RoboDriftSensors M.Trojan J. Trzyna 2014